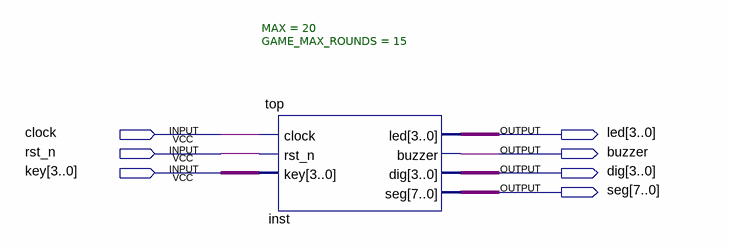
[diagram p0: schematic sheet]
// Quartus schematic top_test.bdf as structural Verilog: 1 symbols, 7 pins
module top_test (
  input  clock,
  input  rst_n,
  input  [3:0] key,
  output [3:0] led,
  output buzzer,
  output [3:0] dig,
  output [7:0] seg
);

  top #(.MAX(20), .GAME_MAX_ROUNDS(15)) inst (
    .clock(clock), .rst_n(rst_n), .key(key), .led(led), .buzzer(buzzer), .dig(dig), .seg(seg));
endmodule
